# Altium schematic sheet 23005_5.SchDoc: Classic Computer IO Platform
size A3; Date: 06/11/2018; CompanyName: Heber Ltd; Organization: Heber Limited; DocumentNumber: 56-23005; Revision: 3; SheetNumber: 5; SheetTotal: 6
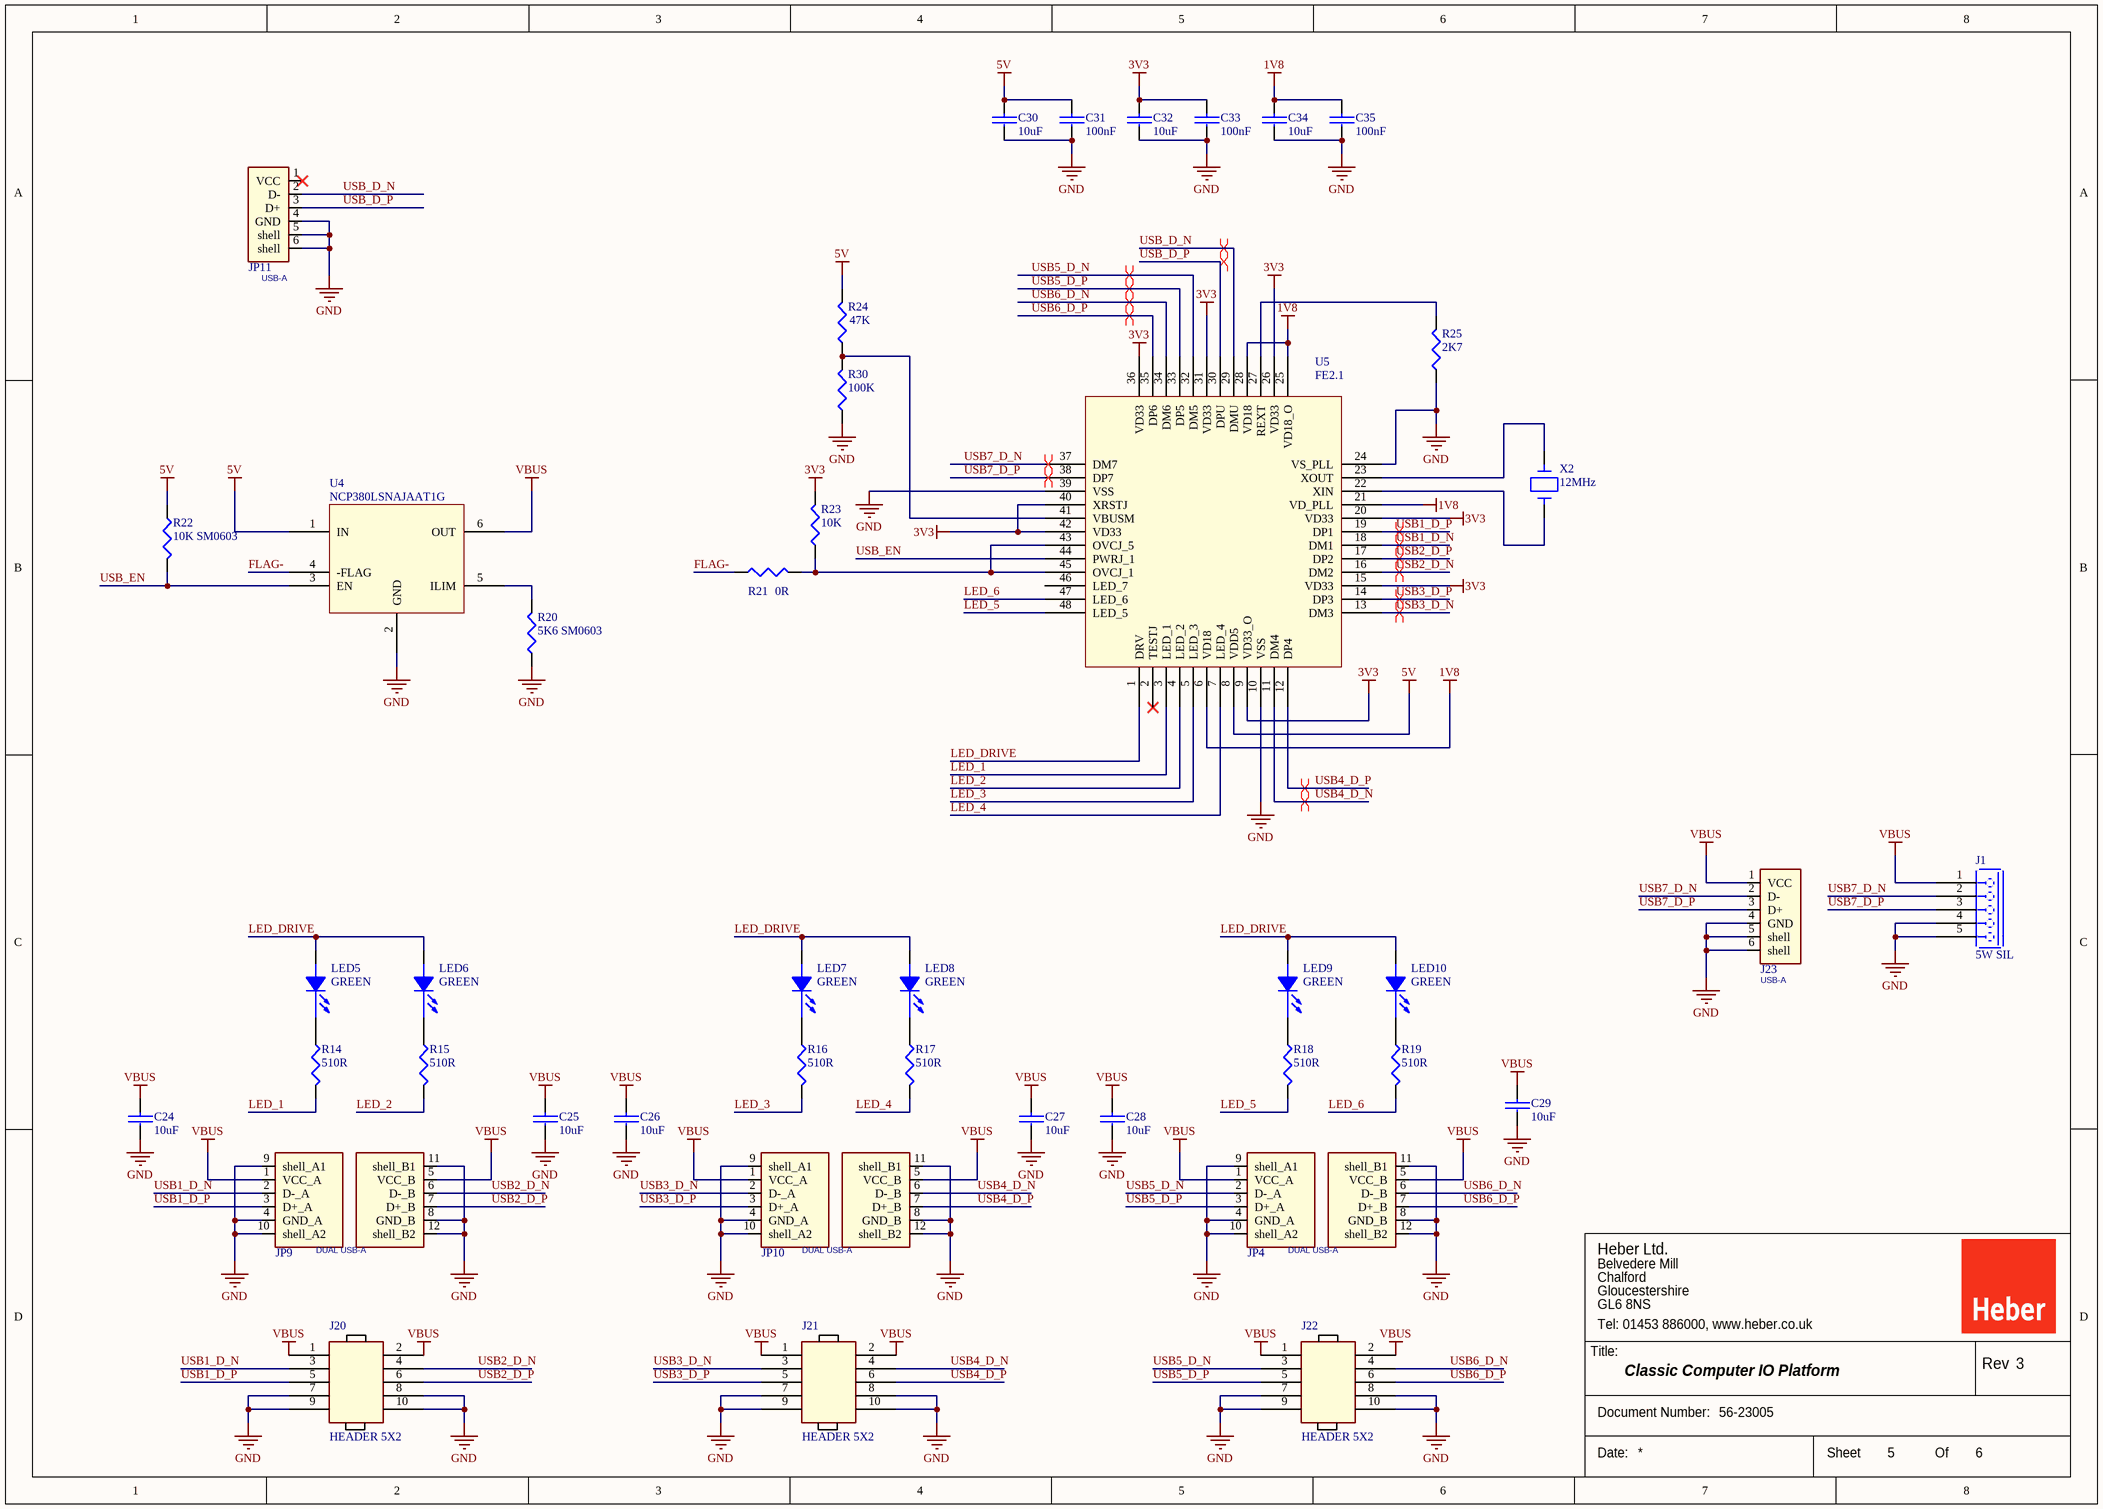
[diagram p0: 23005_5.SchDoc]

## Parts
C24  10uF  [SM0805]
C25  10uF  [SM0805]
C26  10uF  [SM0805]
C27  10uF  [SM0805]
C28  10uF  [SM0805]
C29  10uF  [SM0805]
C30  10uF  [SM0805]
C31  100nF  [SM0603]
C32  10uF  [SM0805]
C33  100nF  [SM0603]
C34  10uF  [SM0805]
C35  100nF  [SM0603]
J1  5W SIL  [5WSIL]
J20  HEADER 5X2  [10WHDR_5X2]
J21  HEADER 5X2  [10WHDR_5X2]
J22  HEADER 5X2  [10WHDR_5X2]
J23  USB-A  [USB_WURTH_61400416021]
JP4  DUAL USB-A  [USB_STACK]
JP9  DUAL USB-A  [USB_STACK]
JP10  DUAL USB-A  [USB_STACK]
JP11  USB-A  [USB_WURTH_61400416021]
LED5  GREEN  [SM0603LED_1]
LED6  GREEN  [SM0603LED_1]
LED7  GREEN  [SM0603LED_1]
LED8  GREEN  [SM0603LED_1]
LED9  GREEN  [SM0603LED_1]
LED10  GREEN  [SM0603LED_1]
R14  510R  [SM0603]
R15  510R  [SM0603]
R16  510R  [SM0603]
R17  510R  [SM0603]
R18  510R  [SM0603]
R19  510R  [SM0603]
R20  5K6 SM0603  [SM0603]
R21  0R  [SM0603]
R22  10K SM0603  [SM0603]
R23  10K  [SM0603]
R24  47K  [SM0603]
R25  2K7  [SM0603]
R30  100K  [SM0603]
U4  NCP380LSNAJAAT1G  [SOT23-6LEAD]
U5  FE2.1  [LQFP48]
X2  12MHz  [HC49_I3]

## Nets
1V8: C34.1 C35.1 U5.6(VD18) U5.21(VD_PLL) U5.25(VD18_O) U5.28(VD18)
3V3: C32.1 C33.1 R23.2 U5.9(VD33_O) U5.15(VD33) U5.20(VD33) U5.26(VD33) U5.31(VD33) U5.36(VD33) U5.40(XRSTJ) U5.42(VD33)
5V: C30.1 C31.1 R22.1 R24.2 U4.1(IN) U5.8(VDD5)
GND: C24.2 C25.2 C26.2 C27.2 C28.2 C29.2 C30.2 C31.2 C32.2 C33.2 C34.2 C35.2 J1.4 J1.5 J20.7 J20.8 J20.9 J20.10 J21.7 J21.8 J21.9 J21.10 J22.7 J22.8 J22.9 J22.10 J23.4(GND) J23.5(shell) J23.6(shell) JP4.4(GND_A) JP4.8(GND_B) JP4.9(shell_A1) JP4.10(shell_A2) JP4.11(shell_B1) JP4.12(shell_B2) JP9.4(GND_A) JP9.8(GND_B) JP9.9(shell_A1) JP9.10(shell_A2) JP9.11(shell_B1) JP9.12(shell_B2) JP10.4(GND_A) JP10.8(GND_B) JP10.9(shell_A1) JP10.10(shell_A2) JP10.11(shell_B1) JP10.12(shell_B2) JP11.4(GND) JP11.5(shell) JP11.6(shell) R20.1 R25.1 R30.1 U4.2(GND) U5.10(VSS) U5.24(VS_PLL) U5.39(VSS)
VBUS: C24.1 C25.1 C26.1 C27.1 C28.1 C29.1 J1.1 J20.1 J20.2 J21.1 J21.2 J22.1 J22.2 J23.1(VCC) JP4.1(VCC_A) JP4.5(VCC_B) JP9.1(VCC_A) JP9.5(VCC_B) JP10.1(VCC_A) JP10.5(VCC_B) U4.6(OUT)
FLAG-: R21.1 U4.4(-FLAG)
LED_1: R14.2 U5.3(LED_1)
LED_2: R15.2 U5.4(LED_2)
LED_3: R16.2 U5.5(LED_3)
LED_4: R17.2 U5.7(LED_4)
LED_5: R18.2 U5.48(LED_5)
LED_6: R19.2 U5.47(LED_6)
LED_DRIVE: LED5.1(ANODE) LED6.1(ANODE) LED7.1(ANODE) LED8.1(ANODE) LED9.1(ANODE) LED10.1(ANODE) U5.1(DRV)
USB1_D_N: J20.3 JP9.2(D-_A) U5.18(DM1)
USB1_D_P: J20.5 JP9.3(D+_A) U5.19(DP1)
USB2_D_N: J20.4 JP9.6(D-_B) U5.16(DM2)
USB2_D_P: J20.6 JP9.7(D+_B) U5.17(DP2)
USB3_D_N: J21.3 JP10.2(D-_A) U5.13(DM3)
USB3_D_P: J21.5 JP10.3(D+_A) U5.14(DP3)
USB4_D_N: J21.4 JP10.6(D-_B) U5.11(DM4)
USB4_D_P: J21.6 JP10.7(D+_B) U5.12(DP4)
USB5_D_N: J22.3 JP4.2(D-_A) U5.32(DM5)
USB5_D_P: J22.5 JP4.3(D+_A) U5.33(DP5)
USB6_D_N: J22.4 JP4.6(D-_B) U5.34(DM6)
USB6_D_P: J22.6 JP4.7(D+_B) U5.35(DP6)
USB7_D_N: J1.2 J23.2(D-) U5.37(DM7)
USB7_D_P: J1.3 J23.3(D+) U5.38(DP7)
USB_D_N: JP11.2(D-) U5.29(DMU)
USB_D_P: JP11.3(D+) U5.30(DPU)
USB_EN: R22.2 U4.3(EN) U5.44(PWRJ_1)
NetLED5_2: LED5.2(CATHODE) R14.1
NetLED6_2: LED6.2(CATHODE) R15.1
NetLED7_2: LED7.2(CATHODE) R16.1
NetLED8_2: LED8.2(CATHODE) R17.1
NetLED9_2: LED9.2(CATHODE) R18.1
NetLED10_2: LED10.2(CATHODE) R19.1
NetR20_2: R20.2 U4.5(ILIM)
NetR21_2: R21.2 R23.1 U5.43(OVCJ_5) U5.45(OVCJ_1)
NetR24_1: R24.1 R30.2 U5.41(VBUSM)
NetR25_2: R25.2 U5.27(REXT)
NetU5_22: U5.22(XIN) X2.2
NetU5_23: U5.23(XOUT) X2.1

Not connected (* = marked no-connect by the designer): JP11 1(VCC)*; U5 2(TESTJ)* 46(LED_7)

## Layout directives
differential pair; differential pair class USB_90R: USB1_D_N, USB1_D_P, USB2_D_N, USB2_D_P, USB3_D_N, USB3_D_P, USB4_D_N, USB4_D_P, USB5_D_N, USB5_D_P, USB6_D_N, USB6_D_P, USB7_D_N, USB7_D_P, USB_D_N, USB_D_P

## Notes on the sheet
- Heber Ltd.
- Belvedere Mill
- Chalford
- GL6 8NS
- Gloucestershire
- Tel: 01453 886000, www.heber.co.uk
- Title:
- Rev
- Document Number:
- Date:
- Sheet
- Of

## Library data of the parts
C24-C35 = C
J1 = HEADER 5W SIL
JP4 JP9 JP10 = USB-A_DUAL
LED5-LED10 = LED
R14-R25 R30 = RES
X2 = XTAL